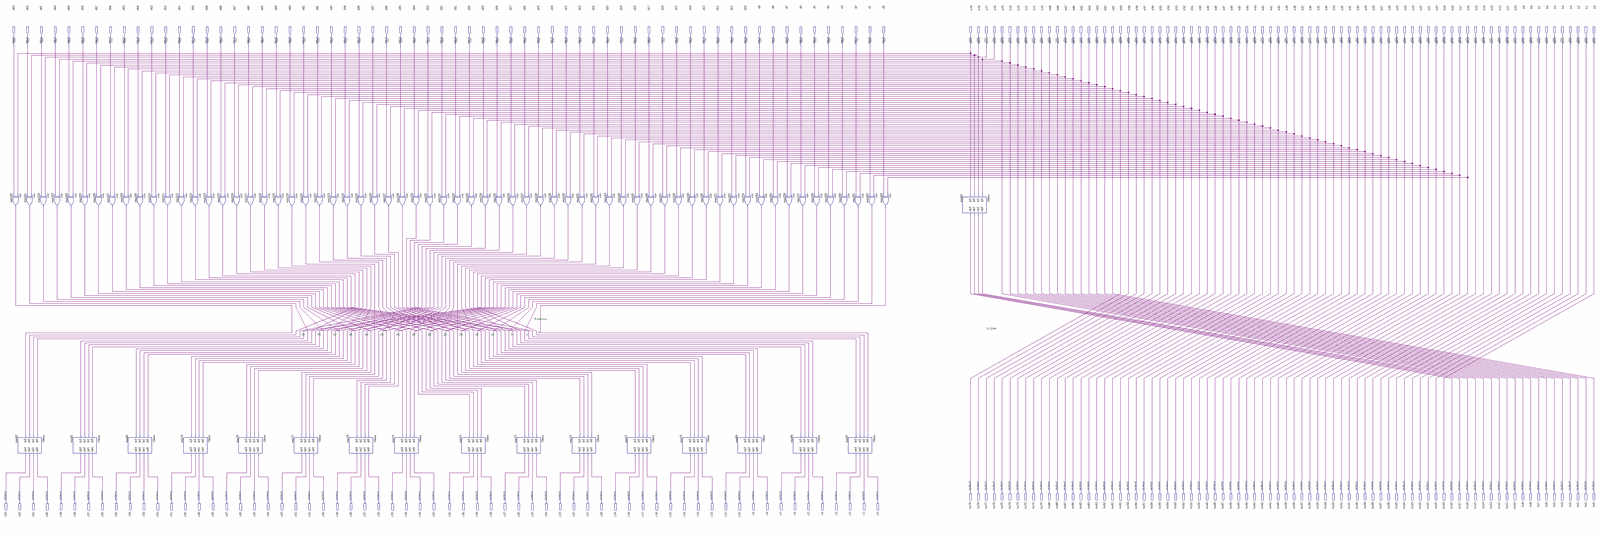
[diagram p0: schematic sheet, whole]
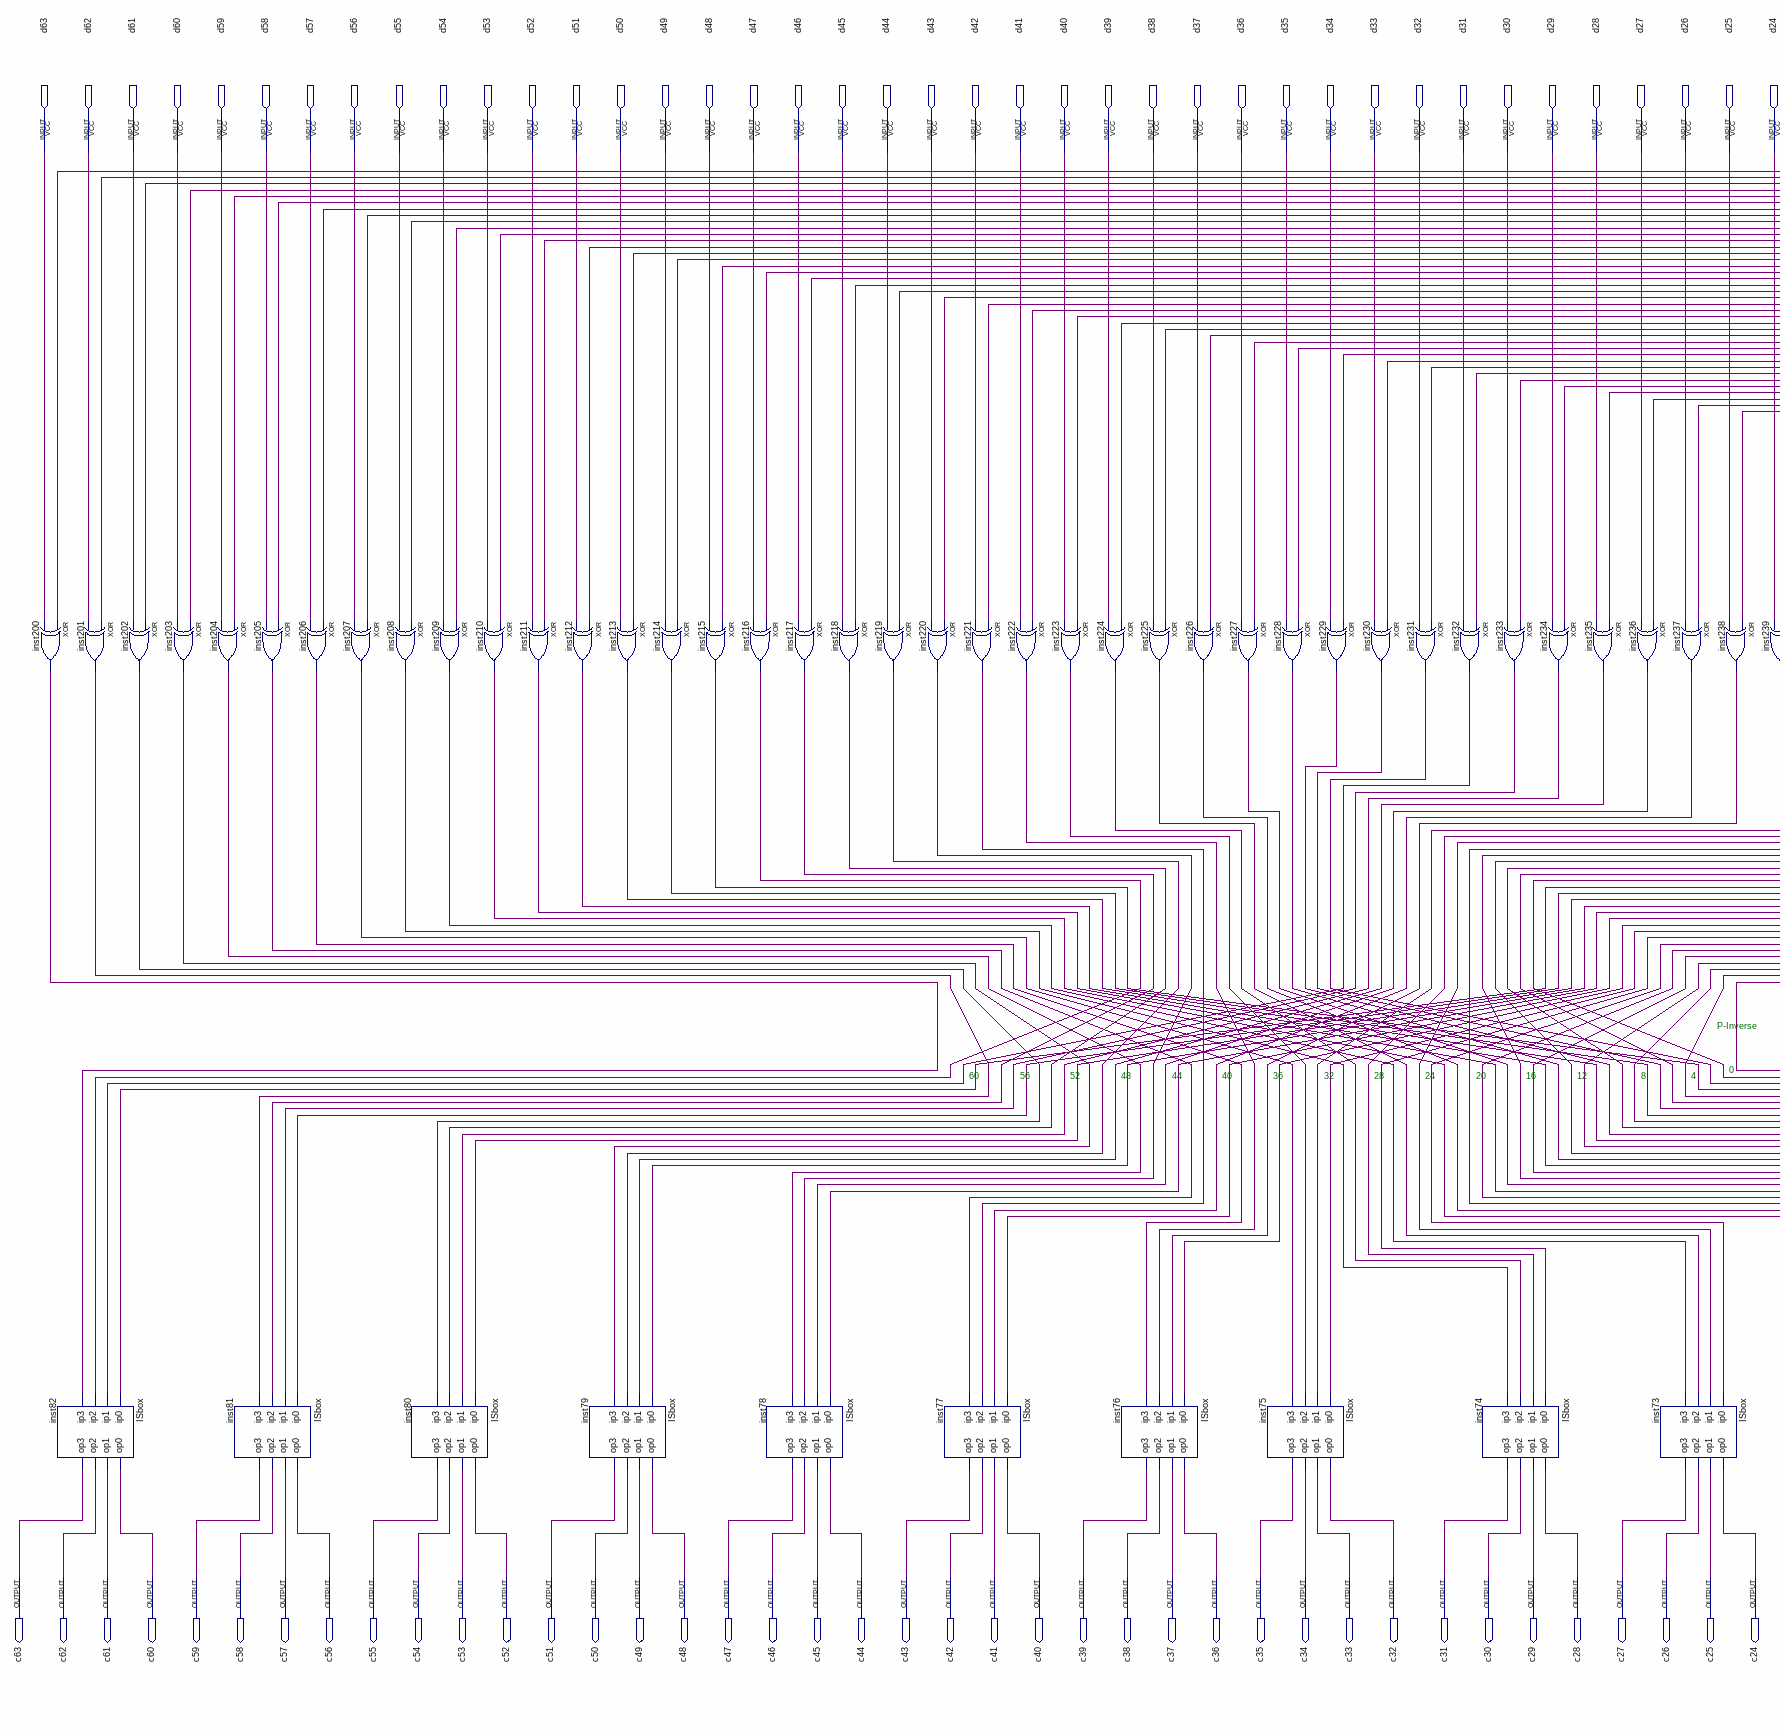
[diagram p1: schematic sheet, left part]
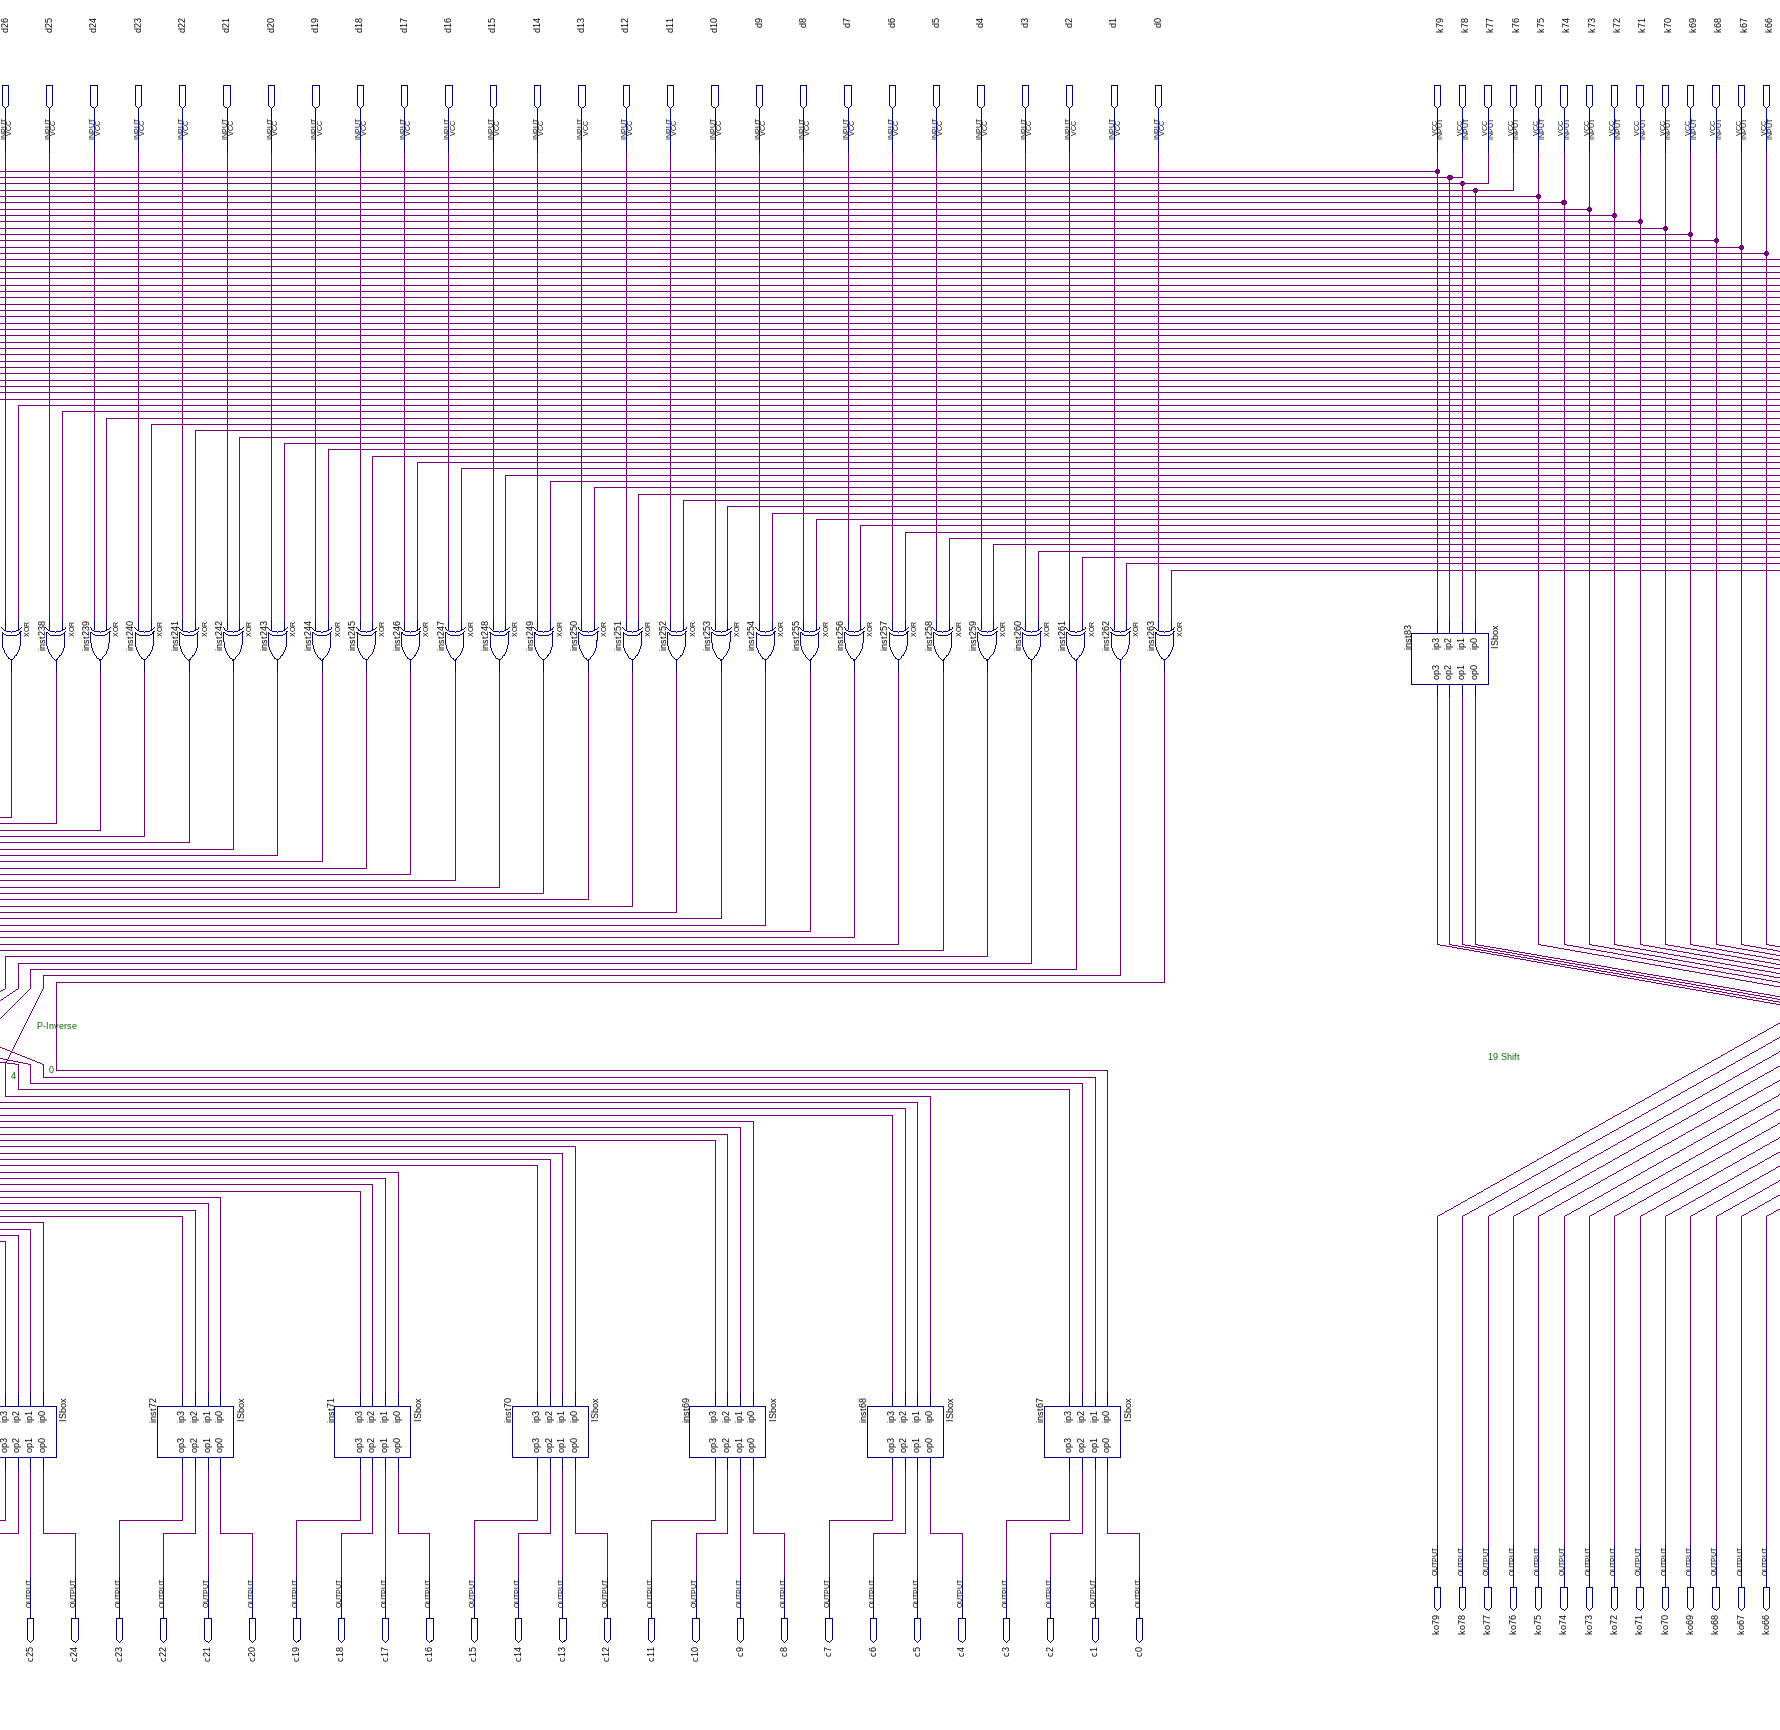
[diagram p2: schematic sheet, centre part]
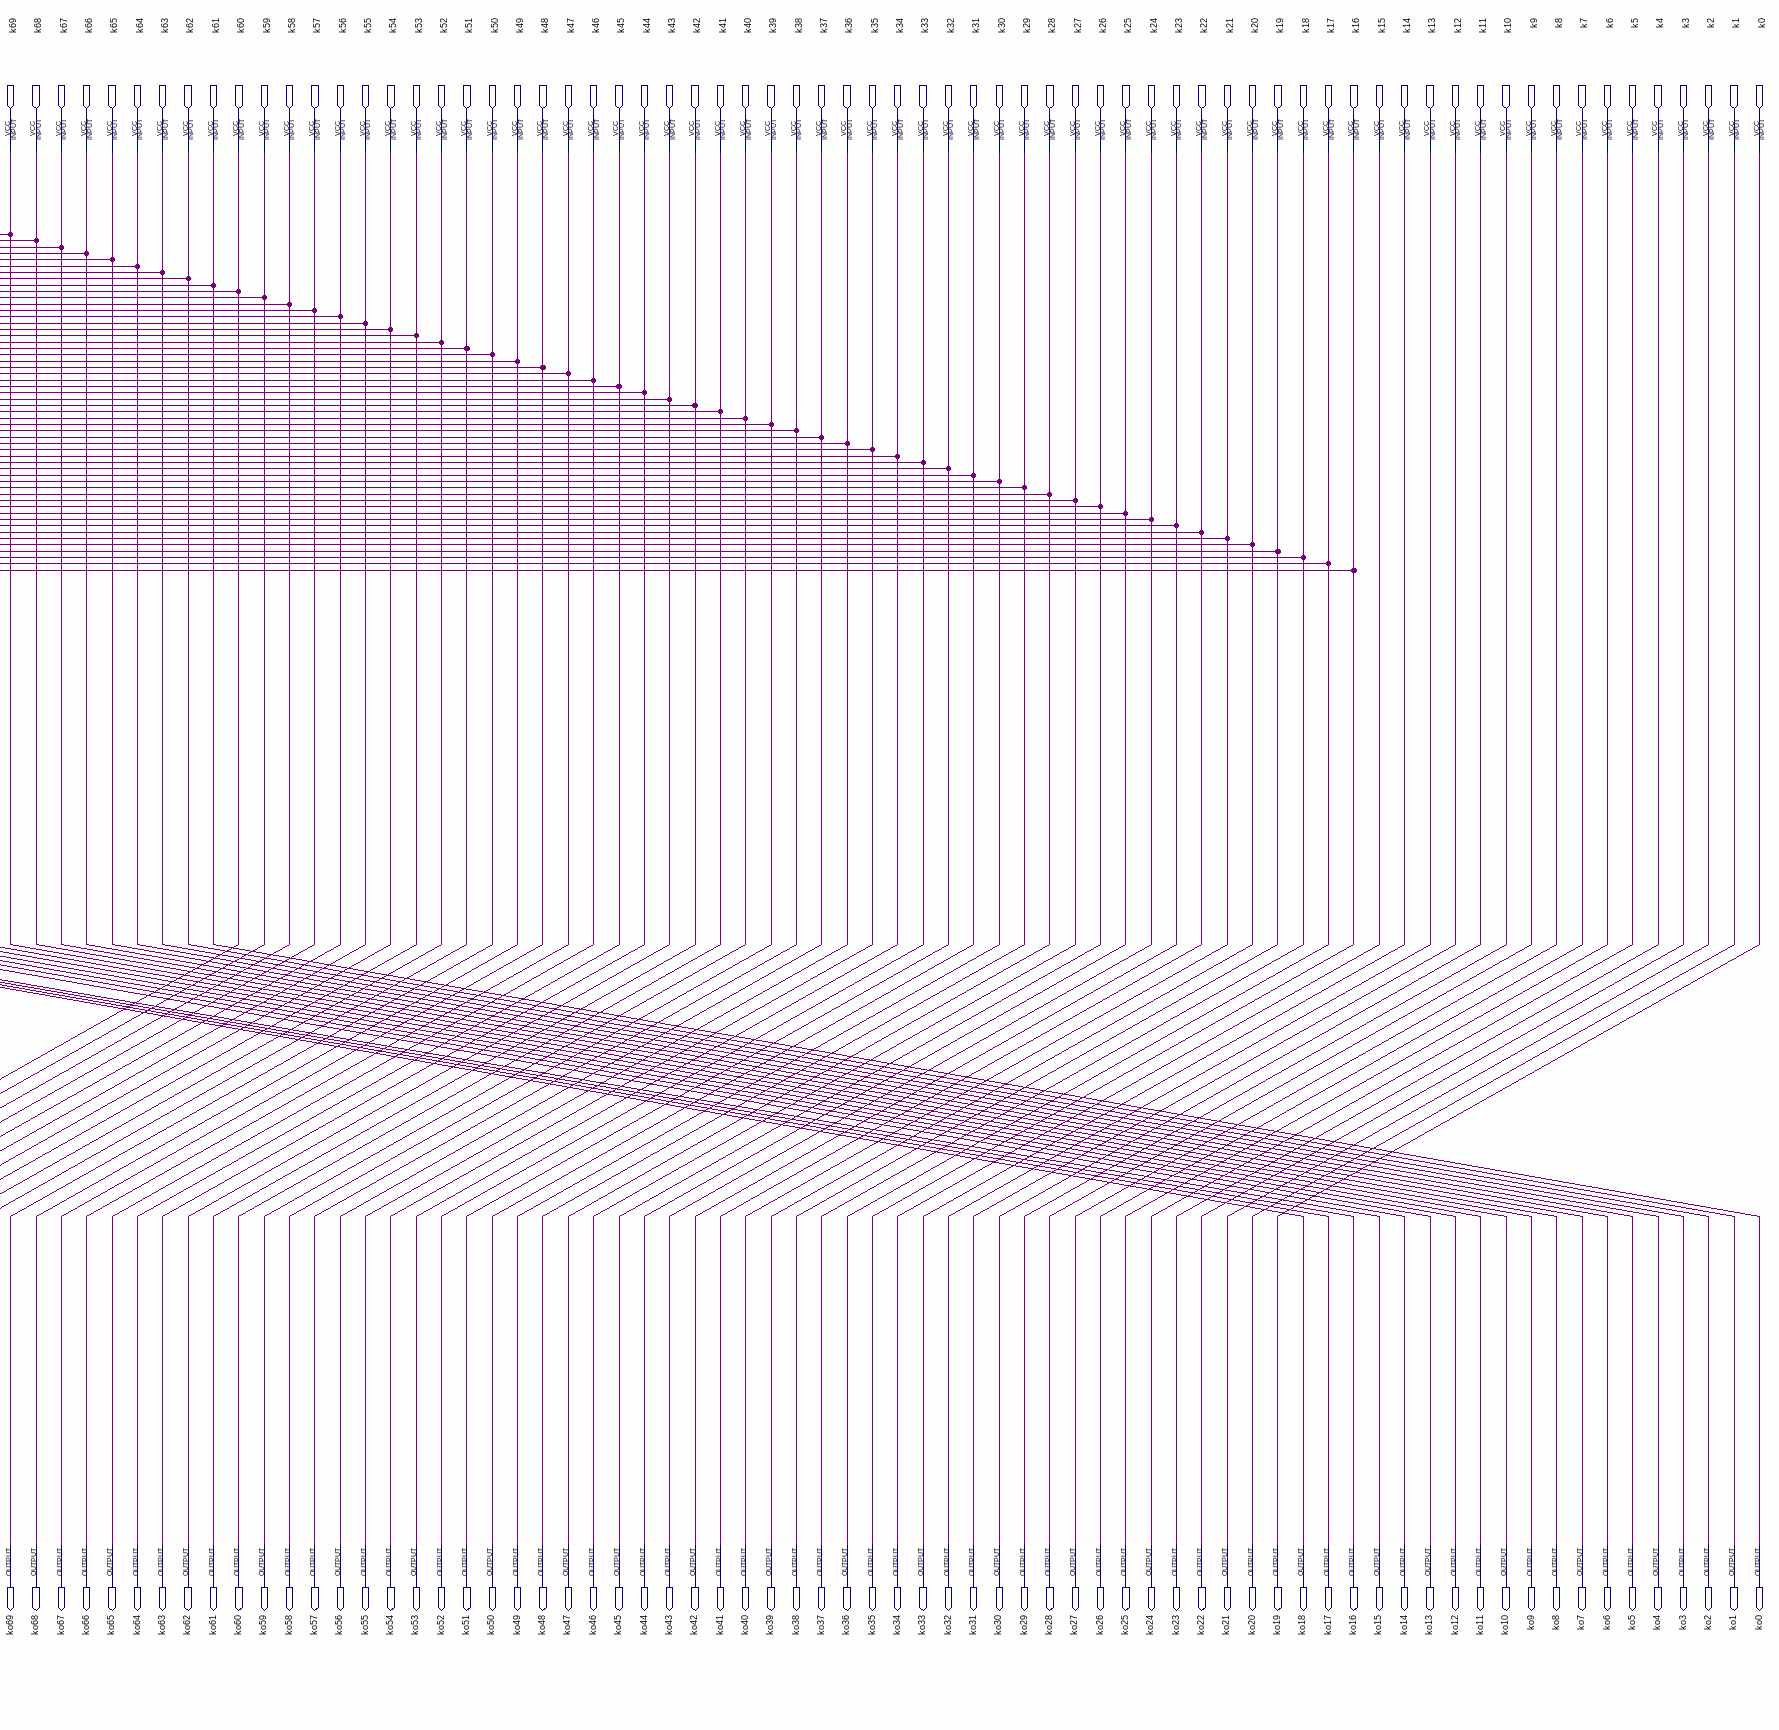
[diagram p3: schematic sheet, right part]
// Quartus schematic OneRound.bdf as structural Verilog: 81 symbols, 288 pins
module OneRound (
  input  d63,
  input  d62,
  input  d61,
  input  d60,
  input  d59,
  input  d58,
  input  d57,
  input  d56,
  input  d55,
  input  d54,
  input  d53,
  input  d52,
  input  d51,
  input  d50,
  input  d49,
  input  d48,
  input  d47,
  input  d46,
  input  d45,
  input  d44,
  input  d43,
  input  d42,
  input  d41,
  input  d40,
  input  d39,
  input  d38,
  input  d37,
  input  d36,
  input  d35,
  input  d34,
  input  d33,
  input  d32,
  input  d31,
  input  d30,
  input  d29,
  input  d28,
  input  d27,
  input  d26,
  input  d25,
  input  d24,
  input  d23,
  input  d22,
  input  d21,
  input  d20,
  input  d19,
  input  d18,
  input  d17,
  input  d16,
  input  d15,
  input  d14,
  input  d13,
  input  d12,
  input  d11,
  input  d10,
  input  d9,
  input  d8,
  input  d7,
  input  d6,
  input  d5,
  input  d4,
  input  d3,
  input  d2,
  input  d1,
  input  d0,
  input  k79,
  input  k78,
  input  k77,
  input  k76,
  input  k75,
  input  k74,
  input  k73,
  input  k72,
  input  k71,
  input  k70,
  input  k69,
  input  k68,
  input  k67,
  input  k66,
  input  k65,
  input  k64,
  input  k63,
  input  k62,
  input  k61,
  input  k60,
  input  k59,
  input  k58,
  input  k57,
  input  k56,
  input  k55,
  input  k54,
  input  k53,
  input  k52,
  input  k51,
  input  k50,
  input  k49,
  input  k48,
  input  k47,
  input  k46,
  input  k45,
  input  k44,
  input  k43,
  input  k42,
  input  k41,
  input  k40,
  input  k39,
  input  k38,
  input  k37,
  input  k36,
  input  k35,
  input  k34,
  input  k33,
  input  k32,
  input  k31,
  input  k30,
  input  k29,
  input  k28,
  input  k27,
  input  k26,
  input  k25,
  input  k24,
  input  k23,
  input  k22,
  input  k21,
  input  k20,
  input  k19,
  input  k18,
  input  k17,
  input  k16,
  input  k15,
  input  k14,
  input  k13,
  input  k12,
  input  k11,
  input  k10,
  input  k9,
  input  k8,
  input  k7,
  input  k6,
  input  k5,
  input  k4,
  input  k3,
  input  k2,
  input  k1,
  input  k0,
  output ko79,
  output ko78,
  output ko77,
  output ko76,
  output ko75,
  output ko74,
  output ko73,
  output ko72,
  output ko71,
  output ko70,
  output ko69,
  output ko68,
  output ko67,
  output ko66,
  output ko65,
  output ko64,
  output ko63,
  output ko62,
  output ko61,
  output ko60,
  output ko59,
  output ko58,
  output ko57,
  output ko56,
  output ko55,
  output ko54,
  output ko53,
  output ko52,
  output ko51,
  output ko50,
  output ko49,
  output ko48,
  output ko47,
  output ko46,
  output ko45,
  output ko44,
  output ko43,
  output ko42,
  output ko41,
  output ko40,
  output ko39,
  output ko38,
  output ko37,
  output ko36,
  output ko35,
  output ko34,
  output ko33,
  output ko32,
  output ko31,
  output ko30,
  output ko29,
  output ko28,
  output ko27,
  output ko26,
  output ko25,
  output ko24,
  output ko23,
  output ko22,
  output ko21,
  output ko20,
  output ko19,
  output ko18,
  output ko17,
  output ko16,
  output ko15,
  output ko14,
  output ko13,
  output ko12,
  output ko11,
  output ko10,
  output ko9,
  output ko8,
  output ko7,
  output ko6,
  output ko5,
  output ko4,
  output ko3,
  output ko2,
  output ko1,
  output ko0,
  output c63,
  output c62,
  output c61,
  output c60,
  output c59,
  output c58,
  output c57,
  output c56,
  output c55,
  output c54,
  output c53,
  output c52,
  output c51,
  output c50,
  output c49,
  output c48,
  output c47,
  output c46,
  output c45,
  output c44,
  output c43,
  output c42,
  output c41,
  output c40,
  output c39,
  output c38,
  output c37,
  output c36,
  output c35,
  output c34,
  output c33,
  output c32,
  output c31,
  output c30,
  output c29,
  output c28,
  output c27,
  output c26,
  output c25,
  output c24,
  output c23,
  output c22,
  output c21,
  output c20,
  output c19,
  output c18,
  output c17,
  output c16,
  output c15,
  output c14,
  output c13,
  output c12,
  output c11,
  output c10,
  output c9,
  output c8,
  output c7,
  output c6,
  output c5,
  output c4,
  output c3,
  output c2,
  output c1,
  output c0
);

  wire inst200_out, inst201_out, inst202_out, inst203_out, inst204_out, inst205_out, inst206_out,
       inst207_out, inst208_out, inst209_out, inst210_out, inst211_out, inst212_out, inst213_out,
       inst214_out, inst215_out, inst216_out, inst217_out, inst218_out, inst219_out, inst220_out,
       inst221_out, inst222_out, inst223_out, inst224_out, inst225_out, inst226_out, inst227_out,
       inst228_out, inst229_out, inst230_out, inst231_out, inst232_out, inst233_out, inst234_out,
       inst235_out, inst236_out, inst237_out, inst238_out, inst239_out, inst240_out, inst241_out,
       inst242_out, inst243_out, inst244_out, inst245_out, inst246_out, inst247_out, inst248_out,
       inst249_out, inst250_out, inst251_out, inst252_out, inst253_out, inst254_out, inst255_out,
       inst256_out, inst257_out, inst258_out, inst259_out, inst260_out, inst261_out, inst262_out, inst263_out;

  xor inst200 (inst200_out, k79, d63);
  ISbox inst82 (
    .ip0(inst248_out), .ip1(inst232_out), .ip2(inst216_out), .ip3(inst200_out), .op0(c60), .op1(c61),
    .op2(c62), .op3(c63));
  xor inst201 (inst201_out, k78, d62);
  xor inst202 (inst202_out, k77, d61);
  xor inst203 (inst203_out, k76, d60);
  xor inst204 (inst204_out, k75, d59);
  ISbox inst81 (
    .ip0(inst249_out), .ip1(inst233_out), .ip2(inst217_out), .ip3(inst201_out), .op0(c56), .op1(c57),
    .op2(c58), .op3(c59));
  xor inst205 (inst205_out, k74, d58);
  xor inst206 (inst206_out, k73, d57);
  xor inst207 (inst207_out, k72, d56);
  xor inst208 (inst208_out, k71, d55);
  ISbox inst80 (
    .ip0(inst250_out), .ip1(inst234_out), .ip2(inst218_out), .ip3(inst202_out), .op0(c52), .op1(c53),
    .op2(c54), .op3(c55));
  xor inst209 (inst209_out, k70, d54);
  xor inst210 (inst210_out, k69, d53);
  xor inst211 (inst211_out, k68, d52);
  xor inst212 (inst212_out, k67, d51);
  ISbox inst79 (
    .ip0(inst251_out), .ip1(inst235_out), .ip2(inst219_out), .ip3(inst203_out), .op0(c48), .op1(c49),
    .op2(c50), .op3(c51));
  xor inst213 (inst213_out, k66, d50);
  xor inst214 (inst214_out, k65, d49);
  xor inst215 (inst215_out, k64, d48);
  xor inst216 (inst216_out, k63, d47);
  ISbox inst78 (
    .ip0(inst252_out), .ip1(inst236_out), .ip2(inst220_out), .ip3(inst204_out), .op0(c44), .op1(c45),
    .op2(c46), .op3(c47));
  xor inst217 (inst217_out, k62, d46);
  xor inst218 (inst218_out, k61, d45);
  xor inst219 (inst219_out, k60, d44);
  xor inst220 (inst220_out, k59, d43);
  ISbox inst77 (
    .ip0(inst253_out), .ip1(inst237_out), .ip2(inst221_out), .ip3(inst205_out), .op0(c40), .op1(c41),
    .op2(c42), .op3(c43));
  xor inst221 (inst221_out, k58, d42);
  xor inst222 (inst222_out, k57, d41);
  xor inst223 (inst223_out, k56, d40);
  xor inst224 (inst224_out, k55, d39);
  ISbox inst76 (
    .ip0(inst254_out), .ip1(inst238_out), .ip2(inst222_out), .ip3(inst206_out), .op0(c36), .op1(c37),
    .op2(c38), .op3(c39));
  xor inst225 (inst225_out, k54, d38);
  xor inst226 (inst226_out, k53, d37);
  xor inst227 (inst227_out, k52, d36);
  xor inst228 (inst228_out, k51, d35);
  ISbox inst75 (
    .ip0(inst255_out), .ip1(inst239_out), .ip2(inst223_out), .ip3(inst207_out), .op0(c32), .op1(c33),
    .op2(c34), .op3(c35));
  xor inst229 (inst229_out, k50, d34);
  xor inst230 (inst230_out, k49, d33);
  xor inst231 (inst231_out, k48, d32);
  xor inst232 (inst232_out, k47, d31);
  ISbox inst74 (
    .ip0(inst256_out), .ip1(inst240_out), .ip2(inst224_out), .ip3(inst208_out), .op0(c28), .op1(c29),
    .op2(c30), .op3(c31));
  xor inst233 (inst233_out, k46, d30);
  xor inst234 (inst234_out, k45, d29);
  xor inst235 (inst235_out, k44, d28);
  xor inst236 (inst236_out, k43, d27);
  xor inst237 (inst237_out, k42, d26);
  ISbox inst73 (
    .ip0(inst257_out), .ip1(inst241_out), .ip2(inst225_out), .ip3(inst209_out), .op0(c24), .op1(c25),
    .op2(c26), .op3(c27));
  xor inst238 (inst238_out, k41, d25);
  xor inst239 (inst239_out, k40, d24);
  xor inst240 (inst240_out, k39, d23);
  ISbox inst72 (
    .ip0(inst258_out), .ip1(inst242_out), .ip2(inst226_out), .ip3(inst210_out), .op0(c20), .op1(c21),
    .op2(c22), .op3(c23));
  xor inst241 (inst241_out, k38, d22);
  xor inst242 (inst242_out, k37, d21);
  xor inst243 (inst243_out, k36, d20);
  xor inst244 (inst244_out, k35, d19);
  xor inst245 (inst245_out, k34, d18);
  ISbox inst71 (
    .ip0(inst259_out), .ip1(inst243_out), .ip2(inst227_out), .ip3(inst211_out), .op0(c16), .op1(c17),
    .op2(c18), .op3(c19));
  xor inst246 (inst246_out, k33, d17);
  xor inst247 (inst247_out, k32, d16);
  xor inst248 (inst248_out, k31, d15);
  ISbox inst70 (
    .ip0(inst260_out), .ip1(inst244_out), .ip2(inst228_out), .ip3(inst212_out), .op0(c12), .op1(c13),
    .op2(c14), .op3(c15));
  xor inst249 (inst249_out, k30, d14);
  xor inst250 (inst250_out, k29, d13);
  xor inst251 (inst251_out, k28, d12);
  xor inst252 (inst252_out, k27, d11);
  xor inst253 (inst253_out, k26, d10);
  ISbox inst69 (
    .ip0(inst261_out), .ip1(inst245_out), .ip2(inst229_out), .ip3(inst213_out), .op0(c8), .op1(c9),
    .op2(c10), .op3(c11));
  xor inst254 (inst254_out, k25, d9);
  xor inst255 (inst255_out, k24, d8);
  xor inst256 (inst256_out, k23, d7);
  ISbox inst68 (
    .ip0(inst262_out), .ip1(inst246_out), .ip2(inst230_out), .ip3(inst214_out), .op0(c4), .op1(c5), .op2(c6),
    .op3(c7));
  xor inst257 (inst257_out, k22, d6);
  xor inst258 (inst258_out, k21, d5);
  xor inst259 (inst259_out, k20, d4);
  xor inst260 (inst260_out, k19, d3);
  xor inst261 (inst261_out, k18, d2);
  ISbox inst67 (
    .ip0(inst263_out), .ip1(inst247_out), .ip2(inst231_out), .ip3(inst215_out), .op0(c0), .op1(c1), .op2(c2),
    .op3(c3));
  xor inst262 (inst262_out, k17, d1);
  xor inst263 (inst263_out, k16, d0);
  ISbox inst83 (.ip0(k76), .ip1(k77), .ip2(k78), .ip3(k79), .op0(ko15), .op1(ko16), .op2(ko17), .op3(ko18));

  assign ko0 = k61;
  assign ko1 = k62;
  assign ko2 = k63;
  assign ko3 = k64;
  assign ko4 = k65;
  assign ko5 = k66;
  assign ko6 = k67;
  assign ko7 = k68;
  assign ko8 = k69;
  assign ko9 = k70;
  assign ko10 = k71;
  assign ko11 = k72;
  assign ko12 = k73;
  assign ko13 = k74;
  assign ko14 = k75;
  assign ko19 = k0;
  assign ko20 = k1;
  assign ko21 = k2;
  assign ko22 = k3;
  assign ko23 = k4;
  assign ko24 = k5;
  assign ko25 = k6;
  assign ko26 = k7;
  assign ko27 = k8;
  assign ko28 = k9;
  assign ko29 = k10;
  assign ko30 = k11;
  assign ko31 = k12;
  assign ko32 = k13;
  assign ko33 = k14;
  assign ko34 = k15;
  assign ko35 = k16;
  assign ko36 = k17;
  assign ko37 = k18;
  assign ko38 = k19;
  assign ko39 = k20;
  assign ko40 = k21;
  assign ko41 = k22;
  assign ko42 = k23;
  assign ko43 = k24;
  assign ko44 = k25;
  assign ko45 = k26;
  assign ko46 = k27;
  assign ko47 = k28;
  assign ko48 = k29;
  assign ko49 = k30;
  assign ko50 = k31;
  assign ko51 = k32;
  assign ko52 = k33;
  assign ko53 = k34;
  assign ko54 = k35;
  assign ko55 = k36;
  assign ko56 = k37;
  assign ko57 = k38;
  assign ko58 = k39;
  assign ko59 = k40;
  assign ko60 = k41;
  assign ko61 = k42;
  assign ko62 = k43;
  assign ko63 = k44;
  assign ko64 = k45;
  assign ko65 = k46;
  assign ko66 = k47;
  assign ko67 = k48;
  assign ko68 = k49;
  assign ko69 = k50;
  assign ko70 = k51;
  assign ko71 = k52;
  assign ko72 = k53;
  assign ko73 = k54;
  assign ko74 = k55;
  assign ko75 = k56;
  assign ko76 = k57;
  assign ko77 = k58;
  assign ko78 = k59;
  assign ko79 = k60;

  // Notes on the sheet:
  //   P-Inverse
  //   19 Shift
  //   0
  //   60
  //   56
  //   52
  //   48
  //   44
  //   40
  //   36
  //   32
  //   28
  //   24
  //   20
  //   16
  //   12
  //   8
  //   4
endmodule
